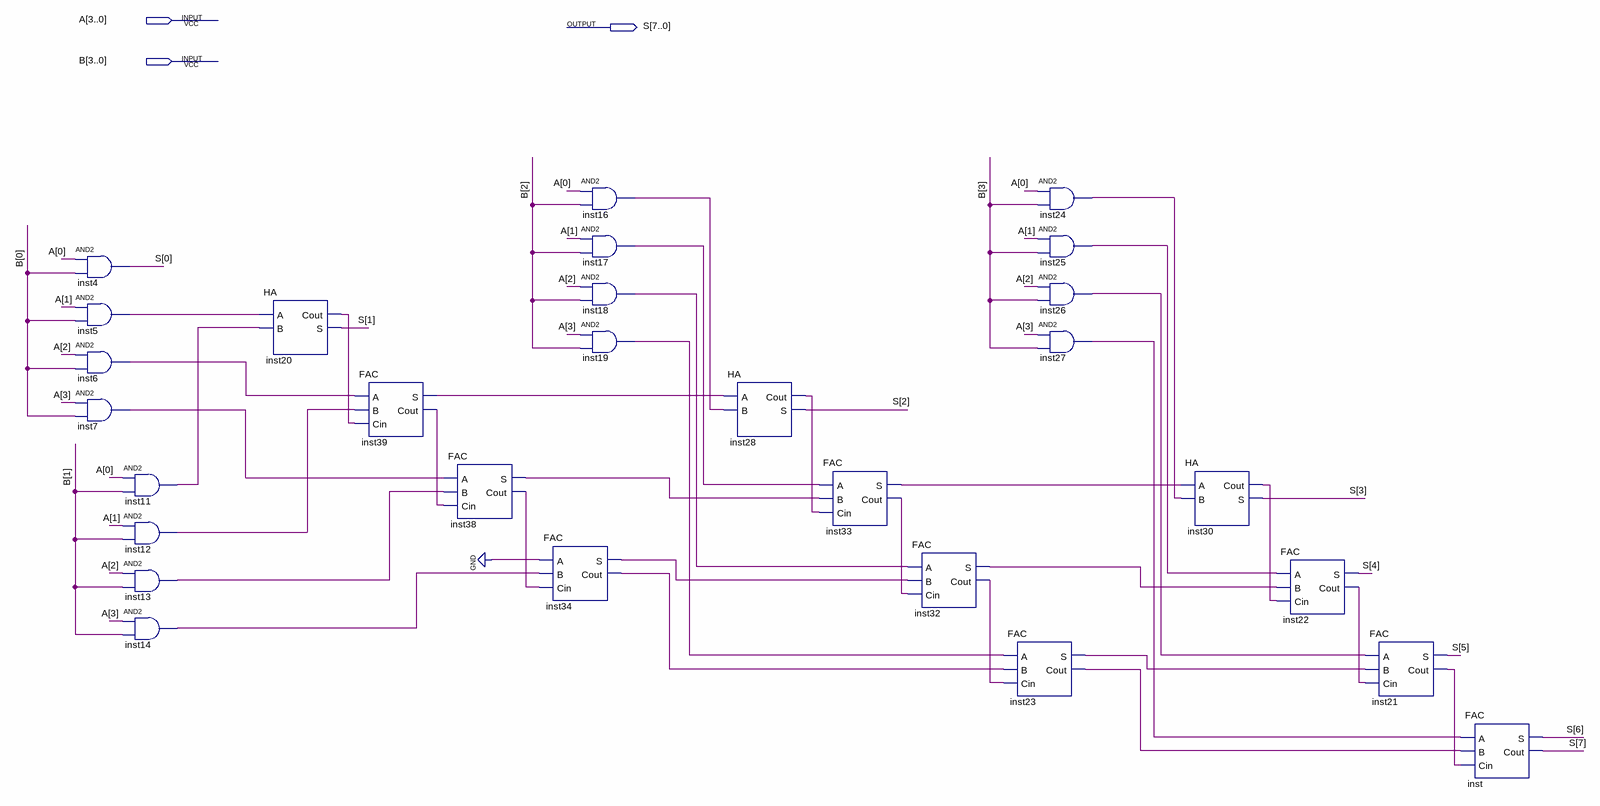
[diagram p0: schematic sheet]
// Quartus schematic MUL8.bdf as structural Verilog: 28 symbols, 3 pins
module MUL8 (
  input  [3:0] A,
  input  [3:0] B,
  output [7:0] S
);

  wire inst5_out, inst6_out, inst7_out, inst11_out, inst12_out, inst13_out, inst14_out, inst16_out,
       inst17_out, inst18_out, inst19_out, inst20_cout, inst21_cout, inst22_cout, inst23_cout, inst23_s,
       inst24_out, inst25_out, inst26_out, inst27_out, inst28_cout, inst30_cout, inst32_cout, inst32_s,
       inst33_cout, inst33_s, inst34_cout, inst34_s, inst38_cout, inst38_s, inst39_cout, inst39_s;

  and inst4 (S[0], A[0], B[0]);
  and inst5 (inst5_out, A[1], B[0]);
  and inst6 (inst6_out, A[2], B[0]);
  and inst7 (inst7_out, A[3], B[0]);
  and inst11 (inst11_out, A[0], B[1]);
  and inst12 (inst12_out, A[1], B[1]);
  and inst13 (inst13_out, A[2], B[1]);
  and inst14 (inst14_out, A[3], B[1]);
  HA inst20 (.A(inst5_out), .B(inst11_out), .Cout(inst20_cout), .S(S[1]));
  FAC inst39 (.A(inst6_out), .B(inst12_out), .Cin(inst20_cout), .S(inst39_s), .Cout(inst39_cout));
  FAC inst38 (.A(inst7_out), .B(inst13_out), .Cin(inst39_cout), .S(inst38_s), .Cout(inst38_cout));
  FAC inst34 (.A(1'b0), .B(inst14_out), .Cin(inst38_cout), .S(inst34_s), .Cout(inst34_cout));
  and inst16 (inst16_out, A[0], B[2]);
  and inst17 (inst17_out, A[1], B[2]);
  and inst18 (inst18_out, A[2], B[2]);
  and inst19 (inst19_out, A[3], B[2]);
  HA inst28 (.A(inst39_s), .B(inst16_out), .Cout(inst28_cout), .S(S[2]));
  FAC inst33 (.A(inst17_out), .B(inst38_s), .Cin(inst28_cout), .S(inst33_s), .Cout(inst33_cout));
  FAC inst32 (.A(inst18_out), .B(inst34_s), .Cin(inst33_cout), .S(inst32_s), .Cout(inst32_cout));
  FAC inst23 (.A(inst19_out), .B(inst34_cout), .Cin(inst32_cout), .S(inst23_s), .Cout(inst23_cout));
  and inst24 (inst24_out, A[0], B[3]);
  and inst25 (inst25_out, A[1], B[3]);
  and inst26 (inst26_out, A[2], B[3]);
  and inst27 (inst27_out, A[3], B[3]);
  HA inst30 (.A(inst33_s), .B(inst24_out), .Cout(inst30_cout), .S(S[3]));
  FAC inst22 (.A(inst25_out), .B(inst32_s), .Cin(inst30_cout), .S(S[4]), .Cout(inst22_cout));
  FAC inst21 (.A(inst26_out), .B(inst23_s), .Cin(inst22_cout), .S(S[5]), .Cout(inst21_cout));
  FAC inst (.A(inst27_out), .B(inst23_cout), .Cin(inst21_cout), .S(S[6]), .Cout(S[7]));
endmodule
